# Altium schematic sheet RarePanel.SchDoc
size A3; SheetNumber: 1; SheetTotal: 1
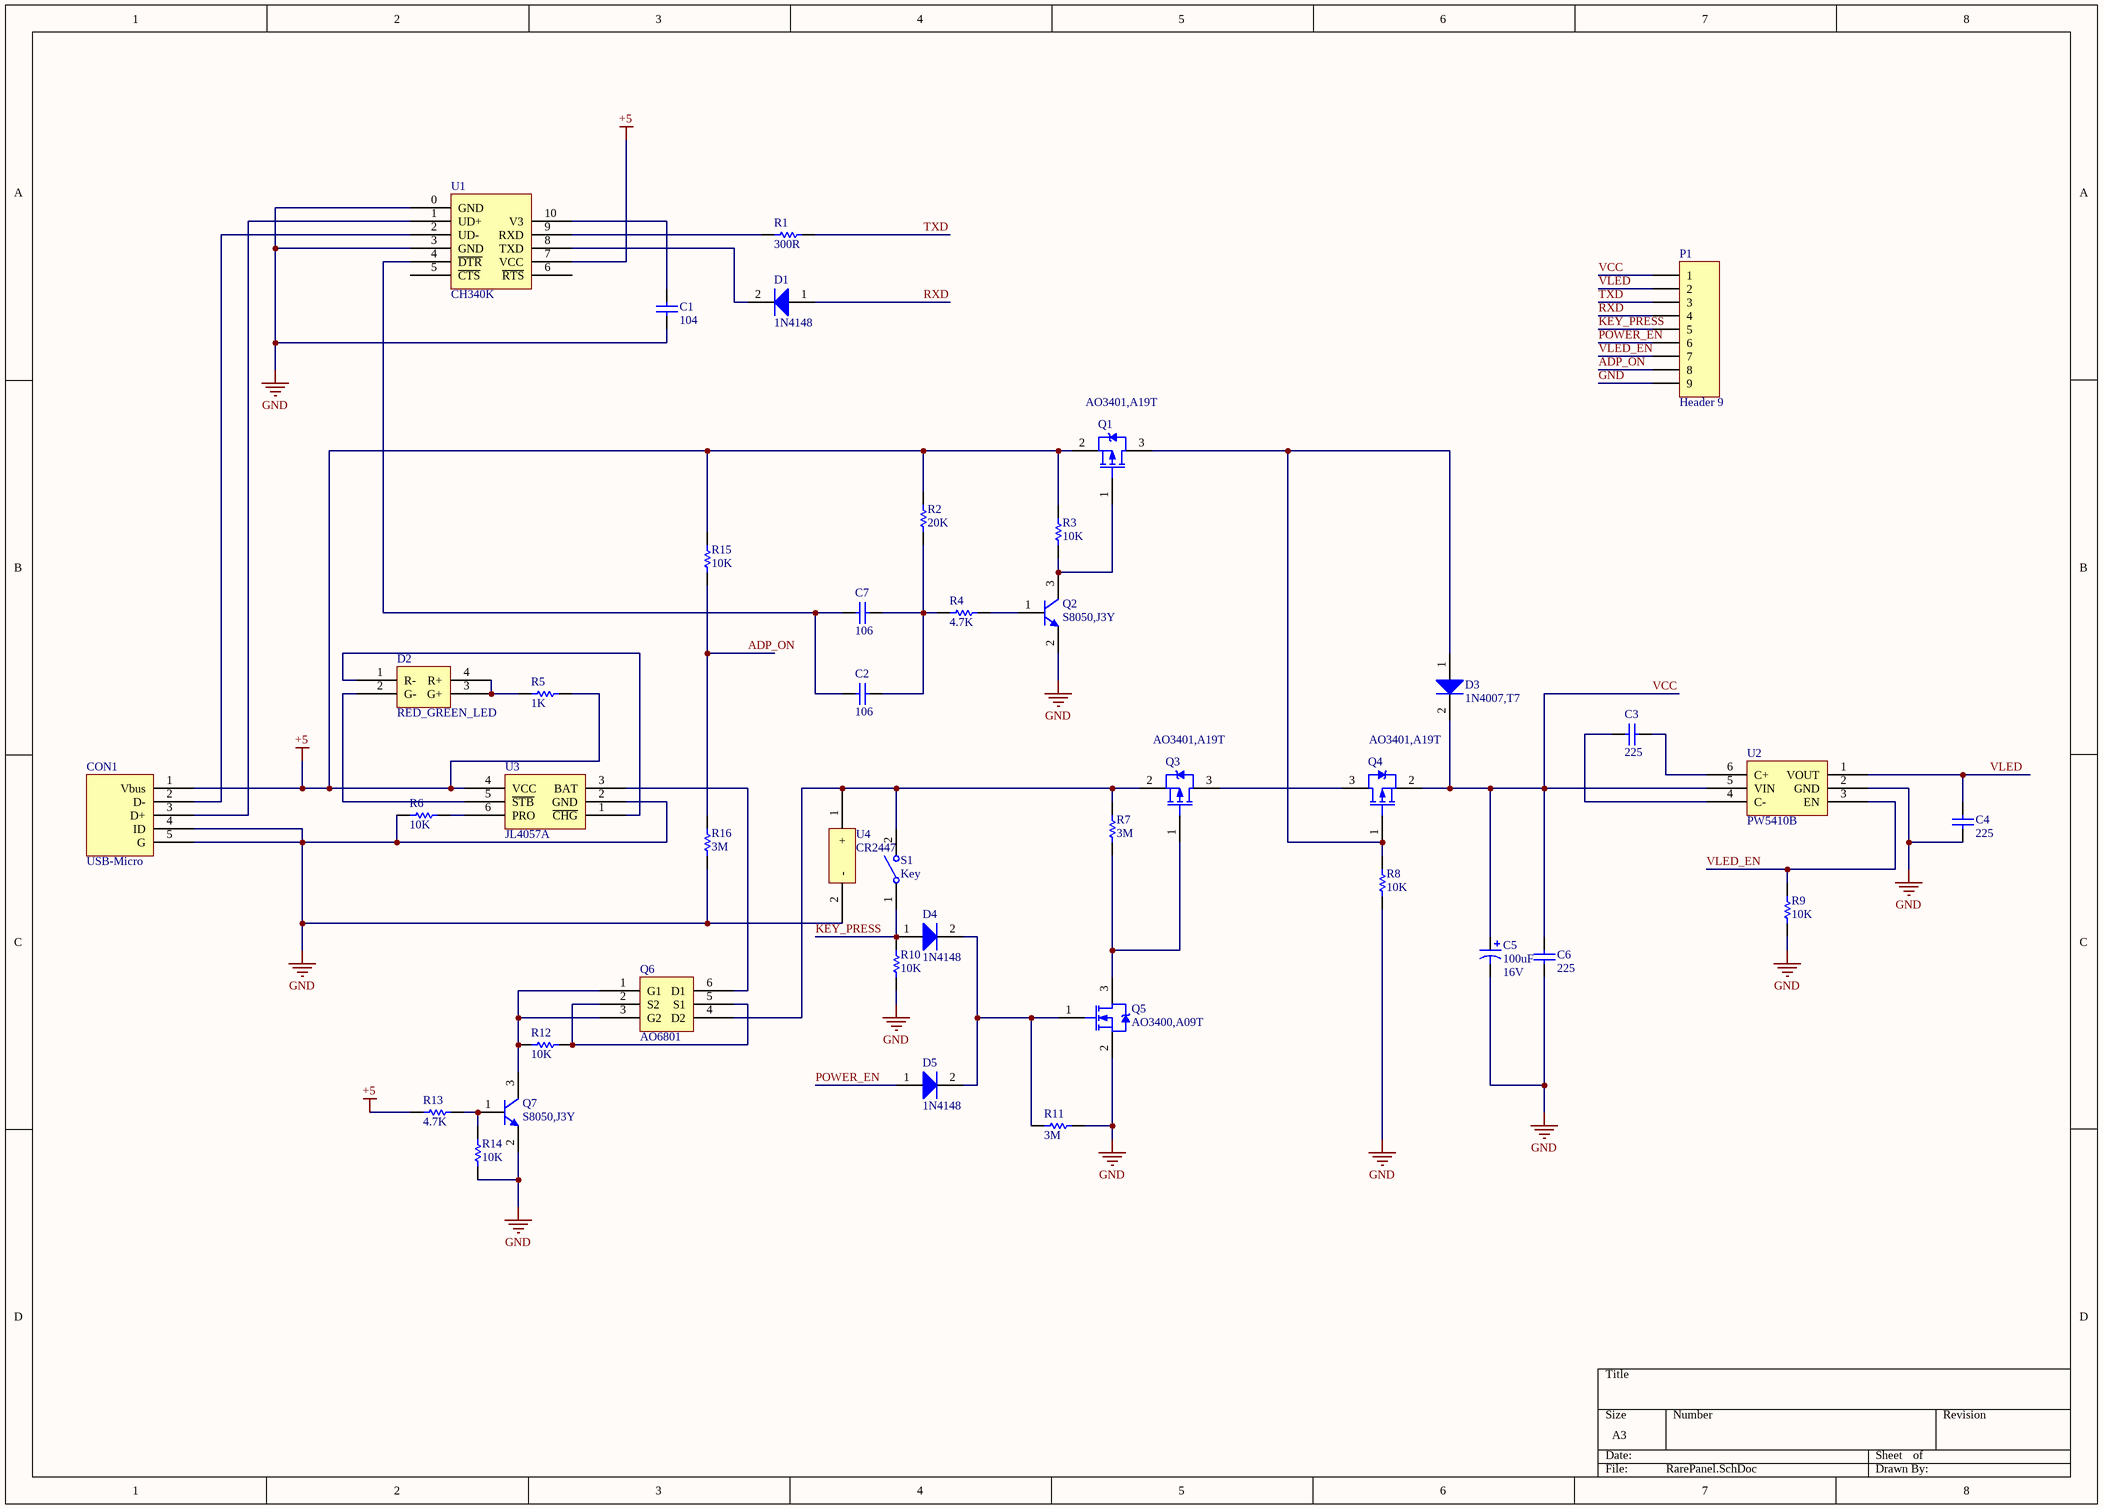
[diagram p0: RarePanel.SchDoc]

## Parts
C1  value 104  [CAPC1608L]
C2  value 106  [CAPC1608L]
C3  value 225  [CAPC1608L]
C4  value 225  [CAPC1608L]
C5  16V  value 100uF  [TC6032-2412]
C6  value 225  [CAPC1608L]
C7  value 106  [CAPC1608L]
CON1  USB-Micro  [USB-micro_B]
D1  1N4148  [CD3216-1206]
D2  RED_GREEN_LED  [RED_GREEN_LED0603]
D3  1N4007,T7  [CD1608-0603-T7]
D4  1N4148  [CD3216-1206]
D5  1N4148  [CD3216-1206]
P1  Header 9  [HDR1X9]
Q1  AO3401,A19T  [SOT-23B_L]
Q2  S8050,J3Y  [SOT-23B_L]
Q3  AO3401,A19T  [SOT-23B_L]
Q4  AO3401,A19T  [SOT-23B_L]
Q5  AO3400,A09T  [SOT-23B_L]
Q6  AO6801  [SOT95P330-6M]
Q7  S8050,J3Y  [SOT-23B_L]
R1  value 300R  [RESC1608L]
R2  value 20K  [RESC1608L]
R3  value 10K  [RESC1608L]
R4  value 4.7K  [RESC1608L]
R5  value 1K  [RESC1608L]
R6  value 10K  [RESC1608L]
R7  value 3M  [RESC1608L]
R8  value 10K  [RESC1608L]
R9  value 10K  [RESC1608L]
R10  value 10K  [RESC1608L]
R11  value 3M  [RESC1608L]
R12  value 10K  [RESC1608L]
R13  value 4.7K  [RESC1608L]
R14  value 10K  [RESC1608L]
R15  value 10K  [RESC1608L]
R16  value 3M  [RESC1608L]
S1  Key  [KEY]
U1  CH340K  [ESOP100-10]
U2  PW5410B  [SOT95P330-6M]
U3  JL4057A  [SOT95P330-6M]
U4  CR2447  [CR2447_WITH_LEAD]

## Nets
+5: CON1.1(Vbus) Q1.2(S) R2.1 R3.2 R5.2 R13.2 R15.1 U1.7(VCC) U3.4(VCC)
GND: C1.1 C4.2 C5.2 C6.2 CON1.4(ID) CON1.5(G) P1.9 Q2.2(E) Q5.2(S) Q7.2(E) R6.1 R8.1 R9.1 R10.1 R11.1 R14.2 R16.2 U1.0(GND) U1.3(GND) U2.2(GND) U3.2(GND) U4.2(-)
ADP_ON: P1.8 R15.2 R16.1
KEY_PRESS: D4.1(A) P1.5 R10.2 S1.1(COMMON)
POWER_EN: D5.1(A) P1.6
RXD: D1.1(A) P1.4
TXD: P1.3 R1.2
VCC: C5.1 C6.1 D3.2(K) P1.1 Q4.2(S) U2.5(VIN)
VLED: C4.1 P1.2 U2.1(VOUT)
VLED_EN: P1.7 R9.2 U2.3(EN)
NetC1_2: C1.2 U1.10(V3)
NetC2_1: C2.1 C7.1 R2.2 R4.2
NetC2_2: C2.2 C7.2 U1.4(~{DTR})
NetC3_1: C3.1 U2.6(C+)
NetC3_2: C3.2 U2.4(C-)
NetCON1_2: CON1.2(D-) U1.2(UD-)
NetCON1_3: CON1.3(D+) U1.1(UD+)
NetD1_2: D1.2(K) U1.8(TXD)
NetD2_1: D2.1(R-) U3.1(~{CHG})
NetD2_2: D2.2(G-) U3.5(~{STB})
NetD2_3: D2.3(G+) D2.4(R+) R5.1
NetD3_1: D3.1(A) Q1.3(D) Q4.1(G) R8.2
NetD4_2: D4.2(K) D5.2(K) Q5.1(G) R11.2
NetQ1_1: Q1.1(G) Q2.3(C) R3.1
NetQ2_1: Q2.1(B) R4.1
NetQ3_1: Q3.1(G) Q5.3(D) R7.1
NetQ3_2: Q3.2(S) Q6.4(D2) R7.2 S1.2(NO) U4.1(+)
NetQ3_3: Q3.3(D) Q4.3(D)
NetQ6_1: Q6.1(G1) Q6.3(G2) Q7.3(C) R12.2
NetQ6_2: Q6.2(S2) Q6.5(S1) R12.1
NetQ6_6: Q6.6(D1) U3.3(BAT)
NetQ7_1: Q7.1(B) R13.1 R14.1
NetR1_1: R1.1 U1.9(RXD)
NetR6_2: R6.2 U3.6(PRO)

Not connected (* = marked no-connect by the designer): U1 5(~{CTS}) 6(~{RTS})

## Library data of the parts
C1-C4 C6 C7 = Cap: Capacitor; Published: 8-Jun-2000; LatestRevisionDate: 17-Jul-2002; LatestRevisionNote: Re-released for DXP Platform.; PackageReference: RAD-0.3; Publisher: Altium Limited; PackageDescription: Radial Cap, Thru-Hole; 2 Leads; 0.3 in Pin Spacing
C5 = Cap Pol1: Polarized Capacitor (Radial); Published: 8-Jun-2000; LatestRevisionDate: 17-Jul-2002; LatestRevisionNote: Re-released for DXP Platform.; PackageReference: RB7.6-15; Publisher: Altium Limited; PackageDescription: Polarized Capacitor (Radial); 2 Leads
D1 D3-D5 = Diode: Default Diode; Published: 8-Jun-2000; LatestRevisionDate: 17-Jul-2002; LatestRevisionNote: Re-released for DXP Platform.; PackageVersion: Sep-1996; PackageReference: SMC; Publisher: Altium Limited; PackageDescription: DO-214-AB/SMC; 2 C-Bend Leads; Body 7.9 x 5.9 mm, inc. leads (LxW); Code_JEDEC: DO-214-AB
P1 = Header 9: Header, 9-Pin; LatestRevisionDate: 17-Jul-2002; LatestRevisionNote: Re-released for DXP Platform.; Publisher: Altium Limited
Q1 Q3 Q4 = PMOS-2: P-Channel Power MOSFET; Note: Pin 4 not drawn and electrically connected to Pin 2.; Published: 8-Jun-2000; LatestRevisionDate: 17-Jul-2002; LatestRevisionNote: Re-released for DXP Platform.; DatasheetVersion: PD-9.390D; PackageVersion: Feb-1997; PackageReference: TO-220AB; Publisher: Altium Limited; PackageDescription: TO, Thru-Hole, Vertical, Heatsink Mounted; 3 In-Line Leads; Pitch 2.54 mm; ComponentLink1Description: Manufacturer Link; ComponentLink1URL: http://www.irf.com/
Q2 Q7 = NPN: NPN Bipolar Transistor; Published: 8-Jun-2000; LatestRevisionDate: 17-Jul-2002; LatestRevisionNote: Re-released for DXP Platform.; PackageReference: TO-226-AA; Publisher: Altium Limited; PackageDescription: TO, Flat Index; 3 In-Line, Axial Leads; Body Dia. 4.8mm; Leads 0.55 x 0.51 mm (max); Code_JEDEC: TO-226-AA
Q5 = NMOS-2: N-Channel Power MOSFET; Note: Pin 2 is electrically connected to pin 4.; Published: 8-Jun-2000; LatestRevisionDate: 17-Jul-2002; LatestRevisionNote: Re-released for DXP Platform.; DatasheetVersion: PD-9.814; PackageVersion: Feb-1997; PackageReference: TO-220AB; Publisher: Altium Limited; PackageDescription: TO, Thru-Hole, Vertical, Heatsink Mounted; 3 In-Line Leads; Pitch 2.54 mm; ComponentLink1Description: Manufacturer Link; ComponentLink1URL: http://www.irf.com/
R1-R16 = Res1: Resistor; Published: 8-Jun-2000; LatestRevisionDate: 17-Jul-2002; LatestRevisionNote: Re-released for DXP Platform.; PackageReference: AXIAL-0.3; Publisher: Altium Limited; PackageDescription: Axial Device, Thru-Hole; 2 Leads; 0.3 in Pin Spacing
S1 = SW-SPST: Single-Pole, Single-Throw Switch; Published: 24-Mar-1999; LatestRevisionDate: 17-Jul-2002; LatestRevisionNote: Re-released for DXP Platform.; PackageReference: SPST-2; Publisher: Altium Limited; PackageDescription: Switch; 2 Leads
U3 = JL4057A: JA4057A